# EAGLE design satshakit_power_board (EAGLE 7.2.0)
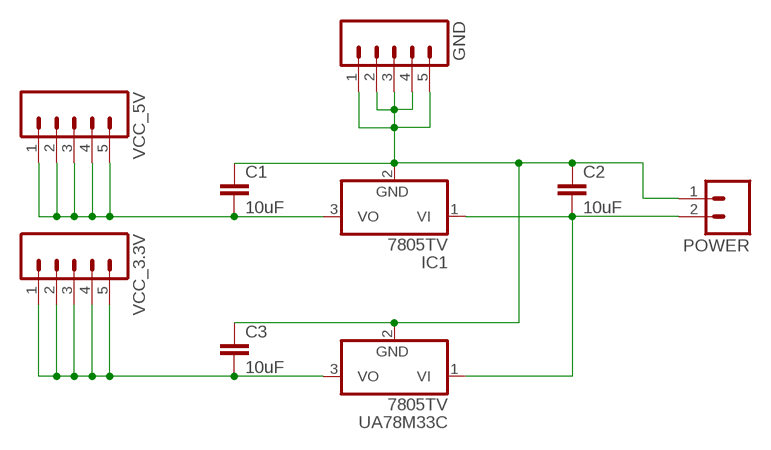
[diagram p0: schematic, sheet 1]

## Parts
C1  10uF  CAP1206  [1206]
C2  10uF  CAP1206  [1206]
C3  10uF  CAP1206  [1206]
GND  M05PTH_LONGPADS  [1X05_LONGPADS]
IC1  7805TV  [TO220V]
POWER  M02  [1X02_LONGPADS]
UA78M33C  7805TV  [TO220V]
VCC_3.3V  M05PTH_LONGPADS  [1X05_LONGPADS]
VCC_5V  M05PTH_LONGPADS  [1X05_LONGPADS]

## Nets
N$1: C3.2 UA78M33C.3(VO) VCC_3.3V.1 VCC_3.3V.2 VCC_3.3V.3 VCC_3.3V.4 VCC_3.3V.5
N$2: C1.2 IC1.3(VO) VCC_5V.1 VCC_5V.2 VCC_5V.3 VCC_5V.4 VCC_5V.5
N$3: C2.2 IC1.1(VI) POWER.2 UA78M33C.1(VI)
N$5: C1.1 C2.1 C3.1 GND.1 GND.2 GND.3 GND.4 GND.5 IC1.2(GND) POWER.1 UA78M33C.2(GND)

## Library data of the parts
C1-C3 = 01_SparkFun:CAP: Capacitor Standard 0603 ceramic capacitor, and 0.1" leaded capacitor.
GND VCC_3.3V VCC_5V = 01_SparkFun:M05: Header 5 Standard 5-pin 0.1" header. Use with straight break away headers (SKU : PRT-00116), right angle break away headers (PRT-00553), swiss pins (PRT-00743), machine pins (PRT-00117), and female headers (PRT-00115). Molex polarized connector foot print use with SKU : PRT-08230 with associated crimp pins and housings.
IC1 UA78M33C = linear:78*: Positive VOLTAGE REGULATOR Source: http://cache.national.com/ds/LM/LM78L05.pdf http://www.fairchildsemi.com/ds/LM/LM7805.pdf
POWER = 01_SparkFun:M02: Header 2 Standard 2-pin 0.1" header. Use with straight break away headers (SKU : PRT-00116), right angle break away headers (PRT-00553), swiss pins (PRT-00743), machine pins (PRT-00117), and female headers (PRT-00115). Molex polarized connector foot print use with SKU : PRT-08233 with associated crimp pins and housings.

## Board
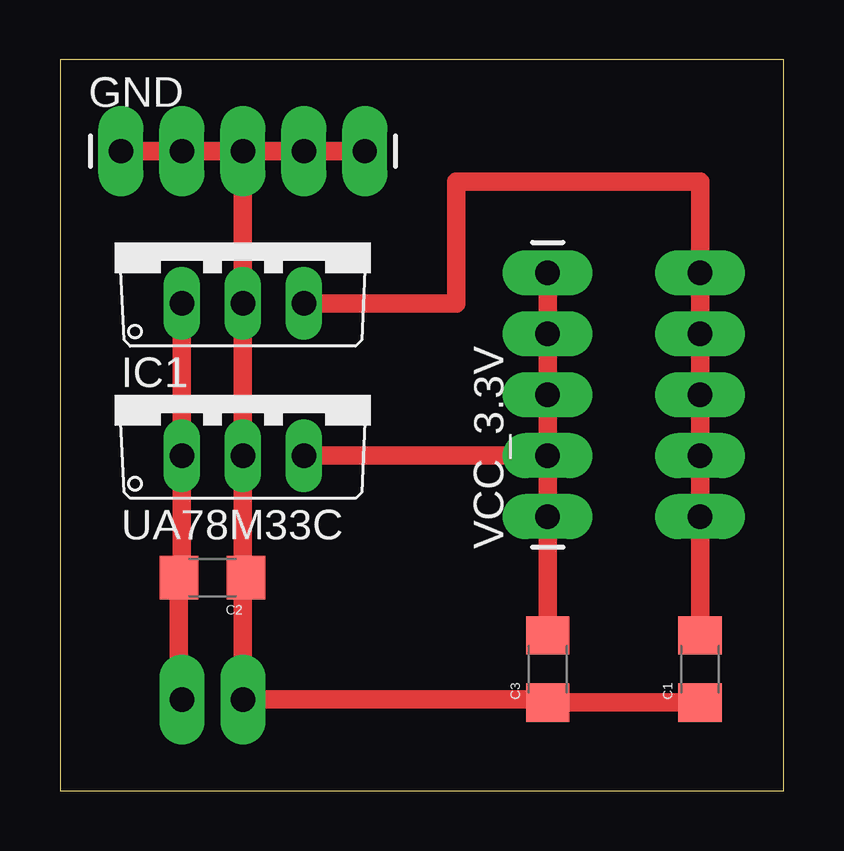
[diagram p1: board, top side]
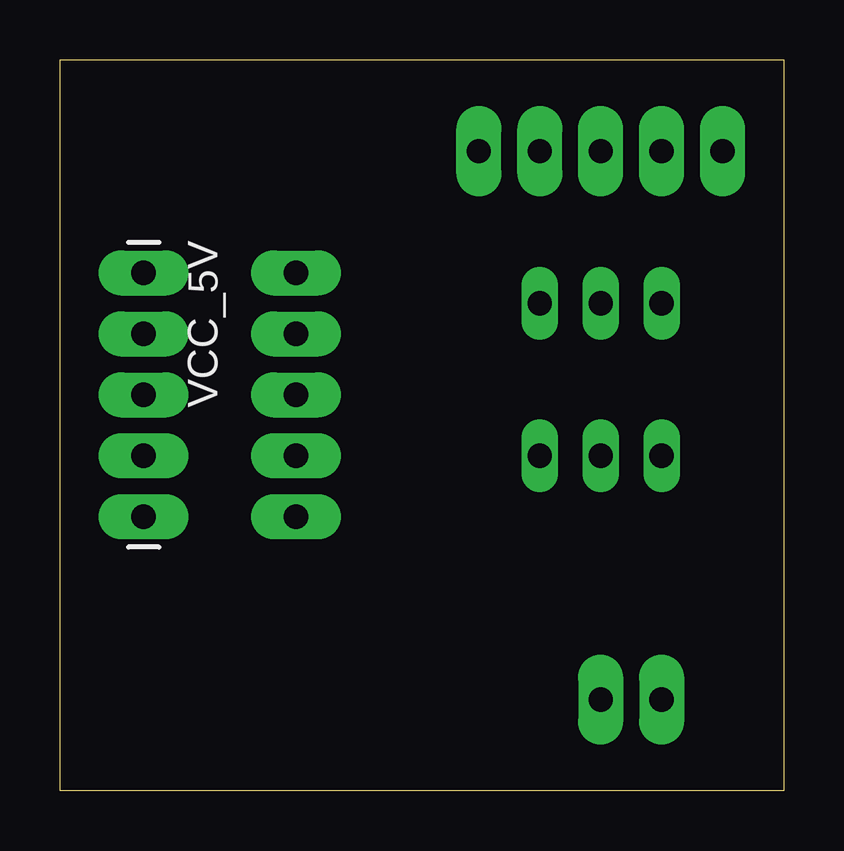
[diagram p2: board, bottom side, seen from below]

Size 30.15 x 30.47 mm. Coordinates in mm from the lower left corner, seen from the top.
Outline: 0,0 30.15,0 30.15,30.47 0,30.47 0,0
Copper layers (1*16): Top 0.035mm / dielectric 1.5mm / Bottom 0.035mm
Design rules "default": minimum track width 10mil, minimum drill 24mil, track to track 8mil, track to pad 8mil, pad to pad 8mil, via to via 8mil, smd to smd 8mil, copper to edge 40mil, drill to drill 8mil, minimum pad ring 10mil, minimum via ring 8mil, stop-mask expansion 4mil, vias tented up to drill 0mil, thermal gap 10mil

### Footprints (pad centres in the part's own frame; a part is rotated, then mirrored left to right if it is on the bottom)
1206 = smd 1.6 x 1.8: 1 -1.4,0; 2 1.4,0
1X05_LONGPADS = drill 1.016 pad 1.88 long: 1 0,0; 2 2.54,0; 3 5.08,0; 4 7.62,0; 5 10.16,0
TO220V = drill 1.016 long: 1 -2.54,-2.54; 2 0,-2.54; 3 2.54,-2.54
1X02_LONGPADS = drill 1.016 pad 1.88 long: 1 0,0; 2 2.54,0

### Placement (x,y rotation side)
C1  26.67,5.08 90 top
C2  6.35,8.89 180 top
C3  20.32,5.08 90 top
GND  2.54,26.67 0 top
IC1  7.62,22.86 0 top
POWER  7.62,3.81 180 top
UA78M33C  7.62,16.51 0 top
VCC_3.3V  20.32,11.43 90 top
VCC_5V  26.67,21.59 270 bottom

### Tracks (layer width: path | path; a pad name or v marks a point on that pad's centre or on a via)
N$1
  Top 0.762: UA78M33C.3 VCC_3.3V.2 | C3.2 VCC_3.3V.1 VCC_3.3V.2 | VCC_3.3V.5 VCC_3.3V.4 VCC_3.3V.3 VCC_3.3V.2
N$2
  Top 0.762: IC1.3 16.51,20.32 16.51,25.4 26.67,25.4 VCC_5V.1 VCC_5V.2 VCC_5V.3 VCC_5V.4 VCC_5V.5 C1.2
N$3
  Top 0.762: POWER.2 4.95,3.81 C2.2 5.08,8.89 UA78M33C.1 IC1.1
N$5
  Top 0.762: 7.62,8.89 UA78M33C.2 IC1.2 GND.3 | GND.3 GND.2 GND.1 | GND.3 GND.4 GND.5 | C2.1 7.62,8.89 | 7.62,8.89 POWER.1 20.32,3.81 C3.1 C1.1